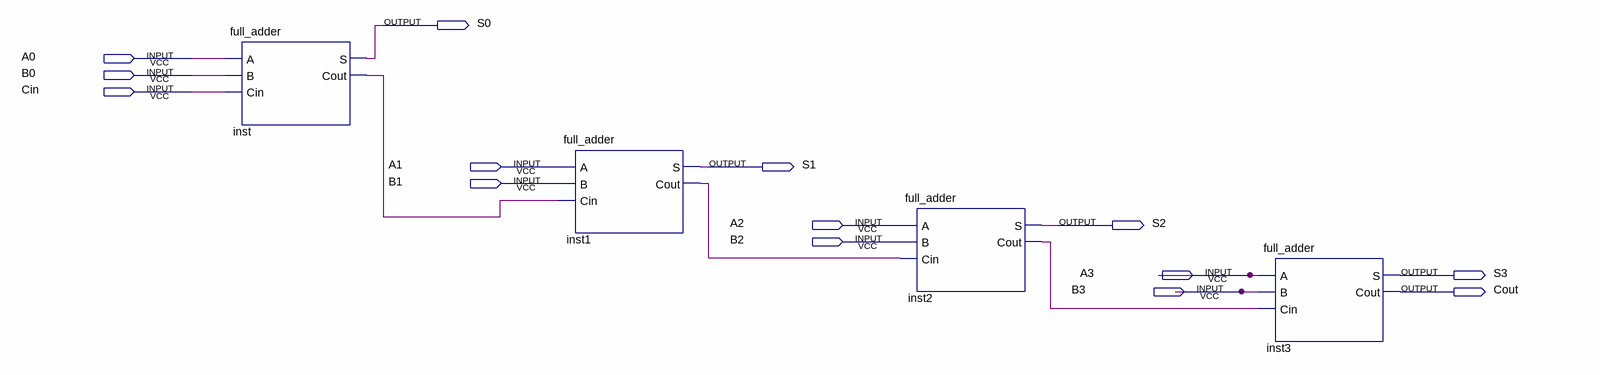
[diagram p0: schematic sheet]
// Quartus schematic full_adder_4b.bdf as structural Verilog: 4 symbols, 14 pins
module full_adder_4b (
  input  A0,
  input  B0,
  input  Cin,
  input  A1,
  input  B1,
  input  A2,
  input  B2,
  input  A3,
  input  B3,
  output S0,
  output S1,
  output S2,
  output S3,
  output Cout
);

  wire inst1_cout, inst2_cout, inst_cout;

  full_adder inst (.A(A0), .B(B0), .Cin(Cin), .S(S0), .Cout(inst_cout));
  full_adder inst1 (.A(A1), .B(B1), .Cin(inst_cout), .S(S1), .Cout(inst1_cout));
  full_adder inst2 (.A(A2), .B(B2), .Cin(inst1_cout), .S(S2), .Cout(inst2_cout));
  full_adder inst3 (.A(A3), .B(B3), .Cin(inst2_cout), .S(S3), .Cout(Cout));
endmodule
